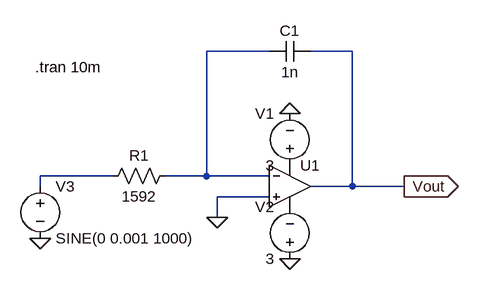
[diagram p0: schematic integrator_sine.asc]
integrator_sine.asc, the LTspice schematic file:
Version 4
SHEET 1 880 680
WIRE 144 -48 48 -48
WIRE 272 -48 208 -48
WIRE -96 144 -208 144
WIRE 48 144 48 -48
WIRE 48 144 -16 144
WIRE 144 144 48 144
WIRE -208 160 -208 144
WIRE 272 160 272 -48
WIRE 272 160 208 160
WIRE 352 160 272 160
WIRE 144 176 64 176
WIRE 64 208 64 176
FLAG 176 272 0
FLAG 176 48 0
FLAG -208 240 0
FLAG 64 208 0
FLAG 352 160 Vout
IOPIN 352 160 Out
SYMBOL OpAmps\\UniversalOpamp2 176 160 R0
SYMATTR InstName U1
SYMATTR Value2 Avol=1Meg GBW=100000Meg Slew=10Meg
SYMBOL voltage 176 144 R180
WINDOW 0 24 96 Left 2
WINDOW 3 24 16 Left 2
WINDOW 123 0 0 Left 0
WINDOW 39 0 0 Left 0
SYMATTR InstName V1
SYMATTR Value 3
SYMBOL voltage 176 288 R180
WINDOW 0 24 96 Left 2
WINDOW 3 24 16 Left 2
WINDOW 123 0 0 Left 0
WINDOW 39 0 0 Left 0
SYMATTR InstName V2
SYMATTR Value 3
SYMBOL res 0 128 R90
WINDOW 0 0 56 VBottom 2
WINDOW 3 32 56 VTop 2
SYMATTR InstName R1
SYMATTR Value 1592
SYMBOL voltage -208 144 R0
WINDOW 123 0 0 Left 0
WINDOW 39 0 0 Left 0
SYMATTR InstName V3
SYMATTR Value SINE(0 0.001 1000)
SYMBOL cap 208 -64 R90
WINDOW 0 0 32 VBottom 2
WINDOW 3 32 32 VTop 2
SYMATTR InstName C1
SYMATTR Value 1n
TEXT -216 -24 Left 2 !.tran 10m

The netlist it stands for:
* integrator_sine.asc
XU1 0 N001 P001 P002 Vout level.2 Avol=1Meg GBW=100000Meg Slew=10Meg ilimit=25m rail=0 Vos=0 phimargin=45 en=0 enk=0 in=0 ink=0 Rin=500Meg  ; pins IN+ IN- V+ V- OUT
V1 P001 0 3
V2 0 P002 3
R1 N001 N002 1592
V3 N002 0 SINE(0 0.001 1000)
C1 Vout N001 1n
.tran 10m
.lib UniversalOpamps2.sub
.backanno
.end